# Altium schematic sheet Main.SchDoc
size 309 x 256 mm; SheetNumber: 1; SheetTotal: 1
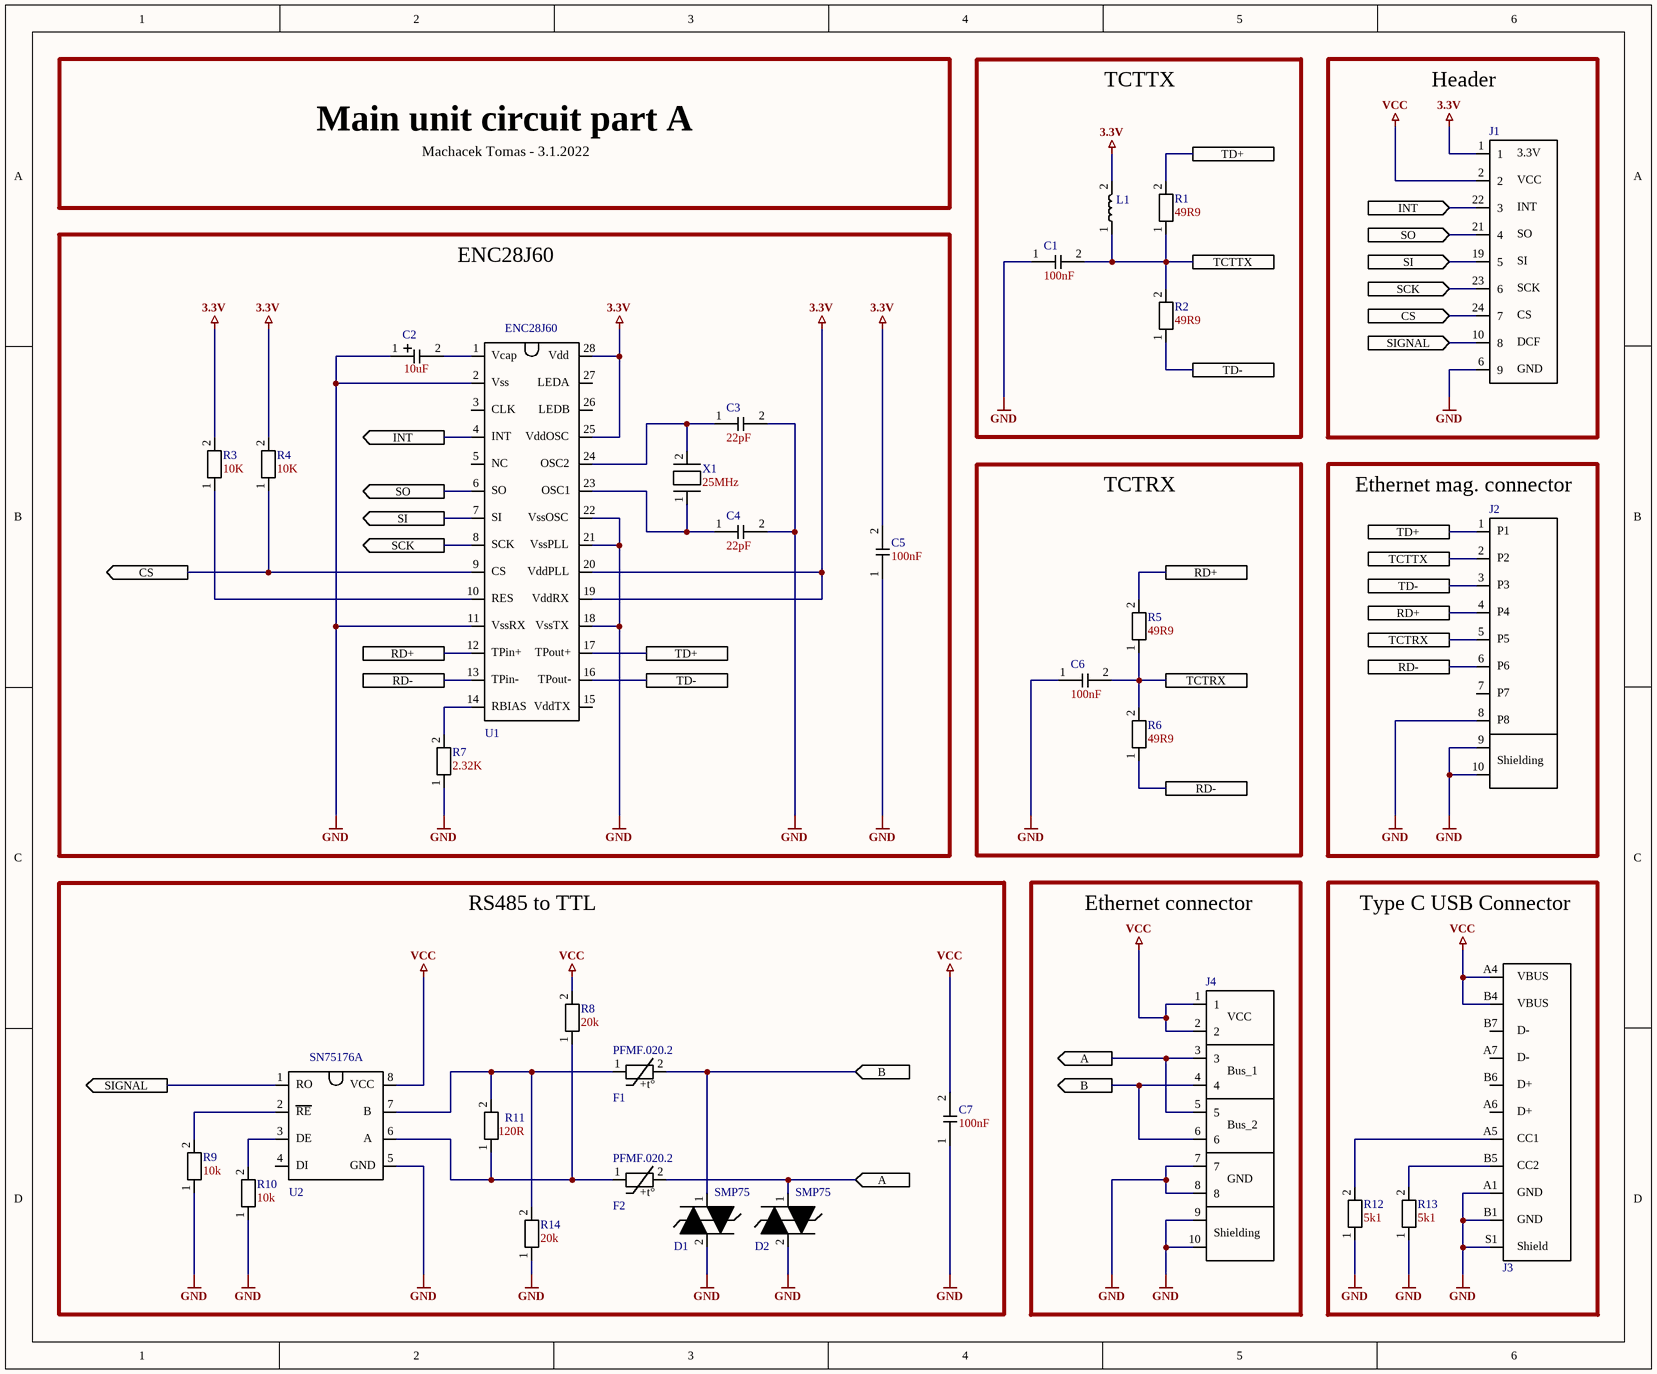
[diagram p0: Main.SchDoc]

## Parts
C1  value 100nF  [MLCC_capacitator]  (hidden comment: Capacitator_MLCC)
C2  value 10uF  [Tantalum_capacitor]  (hidden comment: Capacitator_aluminium)
C3  value 22pF  [MLCC_capacitator]  (hidden comment: Capacitator_MLCC)
C4  value 22pF  [MLCC_capacitator]  (hidden comment: Capacitator_MLCC)
C5  value 100nF  [MLCC_capacitator]  (hidden comment: Capacitator_MLCC)
C6  value 100nF  [MLCC_capacitator]  (hidden comment: Capacitator_MLCC)
C7  value 100nF  [MLCC_capacitator]  (hidden comment: Capacitator_MLCC)
D1  SMP75  [SMP75]
D2  SMP75  [SMP75]
F1  PFMF.020.2  [PFMF.020.2]
F2  PFMF.020.2  [PFMF.020.2]
J1  20x2_header  [20x2_Header]  (value not drawn)
J2  Ethernet_mag_connector  [Ethernet_mag_connector]  (value not drawn)
J3  USB_C_connector  [Usb_c_right_angle]  (value not drawn)
J4  Ethernet_connector  [Ethernet_connector]  (value not drawn)
L1  Ferrite_bead  [Ferrite_bead]  (value not drawn)
R1  value 49R9  [Resistor]  (hidden comment: Resistor)
R2  value 49R9  [Resistor]  (hidden comment: Resistor)
R3  value 10K  [Resistor]  (hidden comment: Resistor)
R4  value 10K  [Resistor]  (hidden comment: Resistor)
R5  value 49R9  [Resistor]  (hidden comment: Resistor)
R6  value 49R9  [Resistor]  (hidden comment: Resistor)
R7  value 2.32K  [Resistor]  (hidden comment: Resistor)
R8  value 20k  [Resistor]  (hidden comment: Resistor)
R9  value 10k  [Resistor]  (hidden comment: Resistor)
R10  value 10k  [Resistor]  (hidden comment: Resistor)
R11  value 120R  [Resistor]  (hidden comment: Resistor)
R12  value 5k1  [Resistor]  (hidden comment: Resistor)
R13  value 5k1  [Resistor]  (hidden comment: Resistor)
R14  value 20k  [Resistor]  (hidden comment: Resistor)
U1  ENC28J60  [ENC28J60]
U2  SN75176A  [SN75176A]
X1  value 25MHz  [Crystal_25MHz]  (hidden comment: Crystal_1)

## Blocks framed on the sheet
TCTTX: C1 L1 R1 R2
Header: J1
ENC28J60: C2-C5 R3 R4 R7 U1 X1
TCTRX: C6 R5 R6
Ethernet mag. connector: J2
RS485 to TTL: C7 D1 D2 F1 F2 R8-R11 R14 U2
Ethernet connector: J4
Type C USB Connector: J3 R12 R13

## Ports
A (in), A (out), B (in), B (out), CS (in), CS (out), INT (in), INT (out), RD+, RD-, SCK (in), SCK (out), SI (in), SI (out), SIGNAL (in), SIGNAL (out), SO (in), SO (out), TCTRX, TCTTX, TD+, TD-

## Nets
3.3V: C5.2 J1.1 L1.2 R3.2 R4.2 U1.19 U1.20 U1.25 U1.28
GND: C1.1 C2.1 C3.2 C4.2 C5.1 C6.1 C7.1 D1.2 D2.2 J1.6(9) J2.8 J2.9 J2.10 J3.A1 J3.B1 J3.S1 J4.7 J4.8 J4.9 J4.10 R7.1 R9.1 R10.1 R12.1 R13.1 R14.1 U1.2 U1.11 U1.18 U1.21 U1.22 U2.5
VCC: C7.2 J1.2 J3.A4 J3.B4 J4.1 J4.2 R8.2 U2.8
A: D2.1 F2.2 J4.3 J4.5 ; port A
B: D1.1 F1.2 J4.4 J4.6 ; port B
CS: J1.24(7) R4.1 U1.9 ; port CS
INT: J1.22(3) U1.4 ; port INT
RD+: J2.4 R5.2 U1.12 ; port RD+
RD-: J2.6 R6.1 U1.13 ; port RD-
SCK: J1.23(6) U1.8 ; port SCK
SI: J1.19(5) U1.7 ; port SI
SIGNAL: J1.10(8) U2.1 ; port SIGNAL
SO: J1.21(4) U1.6 ; port SO
TCTRX: C6.2 J2.5 R5.1 R6.2 ; port TCTRX
TCTTX: C1.2 J2.2 L1.1 R1.1 R2.2 ; port TCTTX
TD+: J2.1 R1.2 U1.17 ; port TD+
TD-: J2.3 R2.1 U1.16 ; port TD-
NetC2_2: C2.2 U1.1
NetC3_1: C3.1 U1.24 X1.2
NetC4_1: C4.1 U1.23 X1.1
NetF1_1: F1.1 R11.2 R14.2 U2.7
NetF2_1: F2.1 R8.1 R11.1 U2.6
NetJ3_A5: J3.A5 R12.2
NetJ3_B5: J3.B5 R13.2
NetR3_1: R3.1 U1.10
NetR7_2: R7.2 U1.14
NetR9_2: R9.2 U2.2
NetR10_2: R10.2 U2.3

Not connected (* = marked no-connect by the designer): J2 7; J3 A6 A7 B6 B7; U1 3 5 15 26 27; U2 4

## Notes on the sheet
- Main unit circuit part A
- Machacek Tomas - 3.1.2022
- (in symbol 20x2_header) 3.3V; VCC; INT; SO; SI; SCK; CS; DCF; GND
- (in symbol ENC28J60) Vcap; Vdd; Vss; LEDA; CLK; LEDB; INT; VddOSC; NC; OSC2; SO; OSC1; SI; VssOSC; SCK; VssPLL; CS; VddPLL; RES; VddRX; VssRX; VssTX; TPin+; TPout+; TPin-; TPout-; RBIAS; VddTX
- (in symbol Ethernet_connector) VCC; Bus_1; Bus_2; GND; Shielding
- (in symbol Ethernet_mag_connector) P1; P2; P3; P4; P5; P6; P7; P8; Shielding
- (in symbol PFMF.020.2) +t°
- (in symbol SN75176A) RO; VCC; RE; B; DE; A; DI; GND
- (in symbol USB_C_connector) VBUS; D-; D+; CC1; CC2; GND; Shield

## Library data of the parts
C1 C3-C7 = Capacitator_MLCC: MLCC capacitator - 1206
C2 = Capacitator_aluminium: Aluminum capacitator - filtration; Supplier 1: Mouser; Supplier Part Number 1: 80-T491A106M010
D1 D2 = SMP75: Bidirectional crowbar protection; Supplier 1: Mouser; Supplier Part Number 1: 511-SMP75-8
F1 F2 = PFMF.020.2: SMD fuse; Supplier 1: Mouser; Supplier Part Number 1: 693-PFMF.020.2
J1 = 20x2_header: 40 position pin header; Supplier 1: Mouser; Supplier Part Number 1: 200-CES12001TD
J2 = Ethernet_mag_connector: Ethernet magnetic connector; Supplier 1: Mouser; Supplier Part Number 1: 571-5-2301995-2
J3 = USB_C_connector: USB type C
J4 = Ethernet_connector: Ethernet connector; Supplier 1: Mouser; Supplier Part Number 1: 571-6368150-1
L1 = Ferrite_bead: Multilayer Ferrite Bead; Supplier 1: Mouser; Supplier Part Number 1: 70-ILB1206ER600V
R1-R14 = Resistor: SMD resistor - 1206
U1 = ENC28J60: Stand-Alone Ethernet Controller with SPI Interface; Supplier 1: Mouser; Supplier Part Number 1: 579-ENC28J60/SS
U2 = SN75176A: RS485 transreciever; Supplier 1: Mouser; Supplier Part Number 1: 595-SN75176ADR
X1 = Crystal_1: Quartz crystal 25MHz